# Altium schematic sheet Driver.SchDoc
size A4; DocumentNumber: 2; SheetNumber: 4; SheetTotal: 15
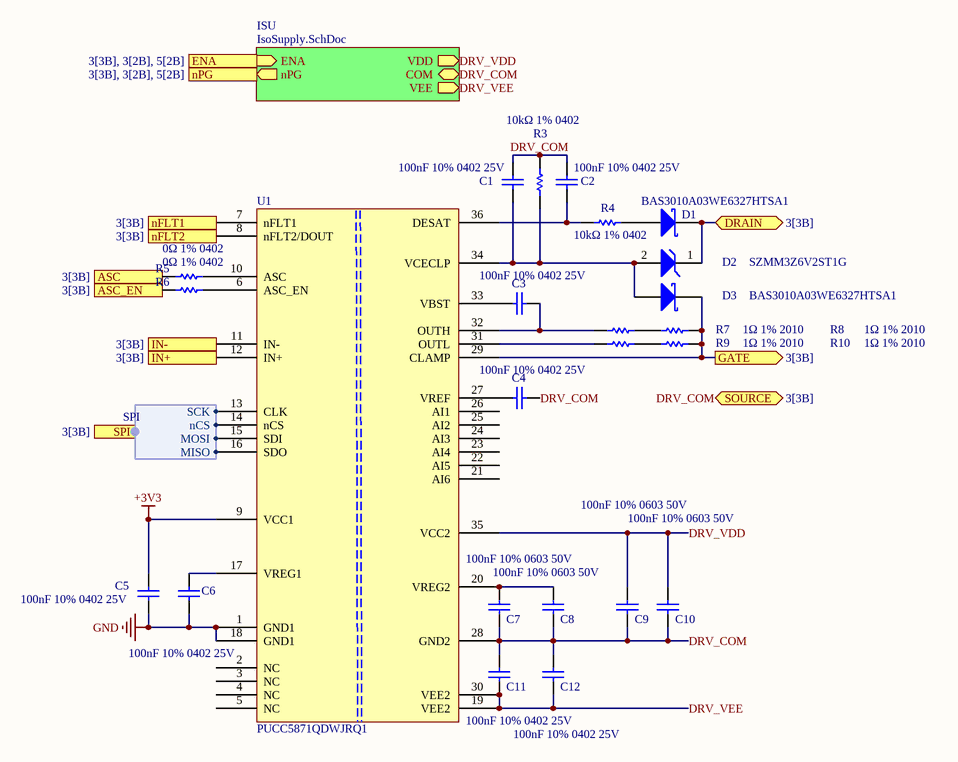
[diagram p0: Driver.SchDoc]

## Parts
C1  100nF 10% 0402 25V  [0402N]
C2  100nF 10% 0402 25V  [0402N]
C3  100nF 10% 0402 25V  [0402N]
C4  100nF 10% 0402 25V  [0402N]
C5  100nF 10% 0402 25V  [0402N]
C6  100nF 10% 0402 25V  [0402N]
C7  100nF 10% 0603 50V  [0603N]
C8  100nF 10% 0603 50V  [0603N]
C9  100nF 10% 0603 50V  [0603N]
C10  100nF 10% 0603 50V  [0603N]
C11  100nF 10% 0402 25V  [0402N]
C12  100nF 10% 0402 25V  [0402N]
D1  BAS3010A03WE6327HTSA1  [INF-SOD323_V]
D2  SZMM3Z6V2ST1G  [ONSC-SOD-323-2-477-02_V]
D3  BAS3010A03WE6327HTSA1  [INF-SOD323_V]
R3  10kΩ 1% 0402  [0402N]
R4  10kΩ 1% 0402  [0402N]
R5  0Ω 1% 0402  [0402N]
R6  0Ω 1% 0402  [0402N]
R7  1Ω 1% 2010  [2010N]
R8  1Ω 1% 2010  [2010N]
R9  1Ω 1% 2010  [2010N]
R10  1Ω 1% 2010  [2010N]
U1  PUCC5871QDWJRQ1  [PUCC5871QDWJRQ1-Footprint-1]

## Sub-sheets
ISU = IsoSupply.SchDoc: VDD (out), VEE (out), COM (bidir), ENA (in), nPG (out)

## Ports
ASC (in, see 3[3B]), ASC_EN (in, see 3[3B]), DRAIN (bidir, see 3[3B]), ENA (in, see 3[3B], 3[2B], 5[2B]), GATE (out, see 3[3B]), IN+ (in, see 3[3B]), IN- (in, see 3[3B]), nFLT1 (out, see 3[3B]), nFLT2 (out, see 3[3B]), nPG (out, see 3[3B], 3[2B], 5[2B]), SOURCE (bidir, see 3[3B]), SPI (harness SPI, see 3[3B])

## Harnesses
SPI: nCS, SCK, MISO, MOSI

## Nets
+3V3: C5.2 U1.9(VCC1)
GND: C5.1 C6.1 U1.1(GND1) U1.18(GND1)
ASC: R5.1 ; port ASC
ASC_EN: R6.1 ; port ASC_EN
DRAIN: D1.1(K) D2.1(K) ; port DRAIN
DRV_COM: C1.2 C2.2 C4.1 C7.2 C8.2 C9.2 C10.2 C11.1 C12.1 R3.1 U1.28(GND2) ; port SOURCE, sheet ISU/COM
DRV_VDD: C9.1 C10.1 U1.35(VCC2) ; sheet ISU/VDD
DRV_VEE: C11.2 C12.2 U1.19(VEE2) U1.30(VEE2) ; sheet ISU/VEE
ENA: port ENA, sheet ISU/ENA
GATE: D3.1(K) R8.2 R10.2 U1.29(CLAMP) ; port GATE
IN+: U1.12(IN+) ; port IN+
IN-: U1.11(IN-) ; port IN-
nFLT1: U1.7(nFLT1) ; port nFLT1
nFLT2: U1.8(nFLT2/DOUT) ; port nFLT2
nPG: port nPG, sheet ISU/nPG
NetC1_1: C1.1 D2.2(A) D3.2(A) R3.2 U1.34(VCECLP)
NetC2_1: C2.1 R4.2 U1.36(DESAT)
NetC3_1: C3.1 R7.1 U1.32(OUTH)
NetC3_2: C3.2 U1.33(VBST)
NetC4_2: C4.2 U1.27(VREF)
NetC6_2: C6.2 U1.17(VREG1)
NetC7_1: C7.1 C8.1 U1.20(VREG2)
NetD1_2: D1.2(A) R4.1
NetR5_2: R5.2 U1.10(ASC)
NetR6_2: R6.2 U1.6(ASC_EN)
NetR7_2: R7.2 R8.1
NetR9_1: R9.1 U1.31(OUTL)
NetR9_2: R9.2 R10.1
NetU1_13: U1.13(CLK) ; port SPI.SCK
NetU1_14: U1.14(nCS) ; port SPI.nCS
NetU1_15: U1.15(SDI) ; port SPI.MOSI
NetU1_16: U1.16(SDO) ; port SPI.MISO

Not connected (* = marked no-connect by the designer): U1 2(NC) 3(NC) 4(NC) 5(NC) 21(AI6) 22(AI5) 23(AI4) 24(AI3) 25(AI2) 26(AI1)

## Library data of the parts
C1-C6 C11 C12 = C0402: Capacitance: 100n; Tolerance: 10; Voltage: 25; Footprint: 0402
C7-C10 = C0603: Capacitance: 100n; Tolerance: 10; Voltage: 50; Footprint: 0603
D1 D3 = CMP-2000-05919-1: Medium Power AF Schottky Diode, 0.41 V, 1 A, -65 to 125 degC, 2-Pin SOD323, RoHS, Tape and Reel; Manufacturer: Infineon; Lead Finish: Tin; Peak Average Forward Current: 1A; Peak Reverse Repetitive Voltage: 30V; Max Processing Temp: 260; Configuration: Single; Screening Level: Automotive; Package Reference: SOD323; Package Description: 2-Pin Small Outline Diode Package, Body 1.25 x 1.7 mm; Manufacturer URL: http://www.infineon.com/; Mounting: SurfaceMount; Mounting Technology: SurfaceMount; Datasheet URL: http://www.infineon.com/dgdl/Infineon-BAS3010ASERIES-DS-v01_01-en.pdf?fileId=db3a30431ddc9372011dfbc50f231c06; Type: SchottkyDiode; Datasheet Version: 04/2007; Operating Temperature: -65to125C; Package URL: http://www.infineon.com/dgdl/SOD323-Package_Overview.pdf?folderId=db3a30431936bc4b011952aab84f3bbe&fileId=db3a30431936bc4b011952beed653be3
D2 = CMP-1060-00681-1: Zener Voltage Regulator, 300 mW, Tight Tolerance Portfolio, 2-Pin SOD-323, Pb-Free, Tape and Reel; Manufacturer: On Semiconductor; P Max (W): 0.3; PartNumber: SZMM3Z6V2ST1G; PackageVersion: Rev. H, 03/2007; RoHS: Pb-Free; ComponentLink1URL: http://www.onsemi.com/; PackageReference: SOD-323-2-477-02; PackageDescription: 2-Pin SOD, Body 1.7 x 1.25 mm; ComponentLink1Description: Manufacturer URL; DatasheetVersion: Rev. 21; Mounting Technology: Surface Mount; ComponentLink2URL: http://www.onsemi.cn/pub_link/Collateral/MM3Z2V4ST1-D.PDF; ComponentLink2Description: Datasheet; ComponentLink3URL: http://www.onsemi.com/pub_link/Collateral/477-02.PDF.1; ComponentLink3Description: Package Specification; Packing: Tape and Reel
R3 R4 = R0402: Resistance: 10k; Tolerance: 1; Footprint: 0402
R5 R6 = R0402: Resistance: 0; Tolerance: 1; Footprint: 0402
R7-R10 = R2010: Resistance: 1; Tolerance: 1; Footprint: 2010
U1 = CMP-00024-00006-2: Automotive 30-A isolated 5.7-kV VRMS IGBT/SiC MOSFET gate driver with advanced protection features 36-SSOP -40 to 125